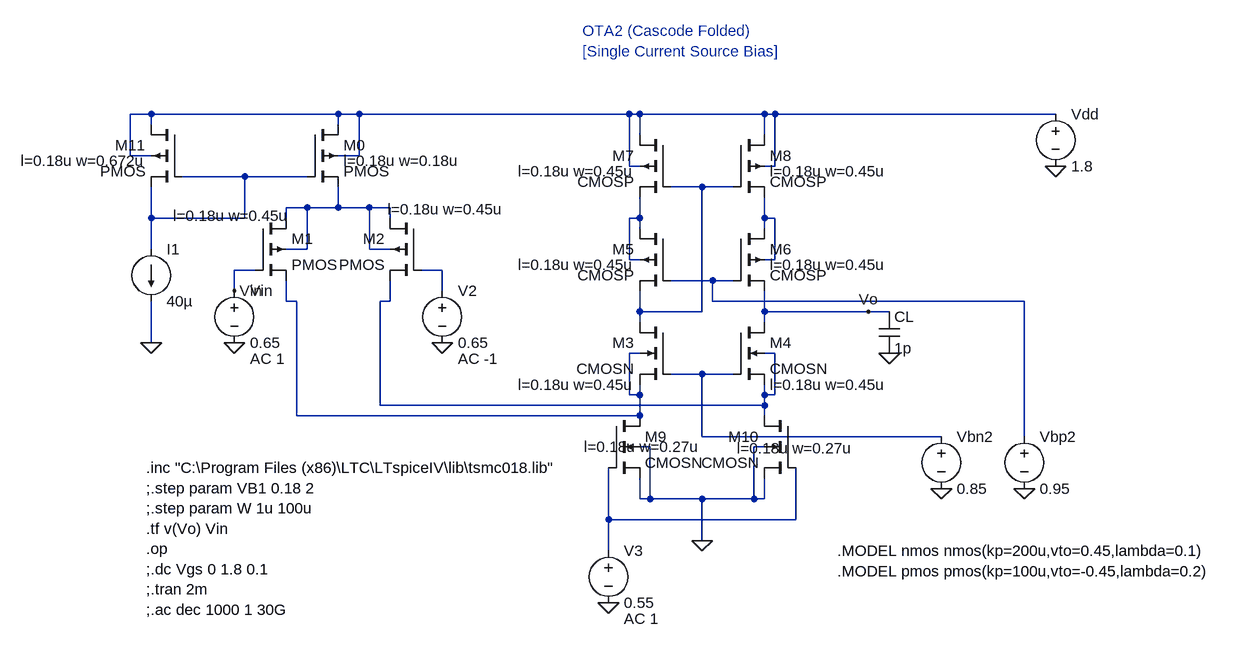
[diagram p0: schematic cascodefolded2.asc]
cascodefolded2.asc, the LTspice schematic file:
Version 4
SHEET 1 2552 708
WIRE -208 -192 -240 -192
WIRE 80 -192 -208 -192
WIRE 112 -192 80 -192
WIRE 528 -192 112 -192
WIRE 544 -192 528 -192
WIRE 736 -192 544 -192
WIRE 752 -192 736 -192
WIRE 1184 -192 752 -192
WIRE -208 -176 -208 -192
WIRE 80 -176 80 -192
WIRE 544 -160 544 -192
WIRE 736 -160 736 -192
WIRE -240 -128 -240 -192
WIRE -208 -128 -240 -128
WIRE 112 -128 112 -192
WIRE 112 -128 80 -128
WIRE 528 -112 528 -192
WIRE 544 -112 528 -112
WIRE 752 -112 752 -192
WIRE 752 -112 736 -112
WIRE -64 -96 -160 -96
WIRE 32 -96 -64 -96
WIRE 640 -80 592 -80
WIRE 688 -80 640 -80
WIRE 32 -48 0 -48
WIRE 80 -48 80 -80
WIRE 80 -48 32 -48
WIRE 128 -48 80 -48
WIRE 160 -48 128 -48
WIRE -208 -32 -208 -80
WIRE -64 -32 -64 -96
WIRE -64 -32 -208 -32
WIRE 0 -32 0 -48
WIRE 160 -32 160 -48
WIRE 544 -32 544 -64
WIRE 544 -32 528 -32
WIRE 736 -32 736 -64
WIRE 752 -32 736 -32
WIRE 544 -16 544 -32
WIRE 736 -16 736 -32
WIRE -208 16 -208 -32
WIRE 32 16 32 -48
WIRE 32 16 0 16
WIRE 128 16 128 -48
WIRE 160 16 128 16
WIRE 528 32 528 -32
WIRE 544 32 528 32
WIRE 752 32 752 -32
WIRE 752 32 736 32
WIRE -48 48 -80 48
WIRE 240 48 208 48
WIRE 656 64 592 64
WIRE 688 64 656 64
WIRE -80 80 -80 48
WIRE 240 80 240 48
WIRE 0 96 0 64
WIRE 16 96 0 96
WIRE 160 96 160 64
WIRE 160 96 144 96
WIRE 656 96 656 64
WIRE 1136 96 656 96
WIRE 544 112 544 80
WIRE 640 112 640 -80
WIRE 640 112 544 112
WIRE 736 112 736 80
WIRE 896 112 736 112
WIRE 928 112 896 112
WIRE 544 128 544 112
WIRE 736 128 736 112
WIRE -208 160 -208 96
WIRE 544 176 528 176
WIRE 752 176 736 176
WIRE 640 208 592 208
WIRE 688 208 640 208
WIRE 528 240 528 176
WIRE 544 240 544 224
WIRE 544 240 528 240
WIRE 736 240 736 224
WIRE 752 240 752 176
WIRE 752 240 736 240
WIRE 144 256 144 96
WIRE 736 256 736 240
WIRE 736 256 144 256
WIRE 16 272 16 96
WIRE 544 272 544 240
WIRE 544 272 16 272
WIRE 736 272 736 256
WIRE 640 304 640 208
WIRE 1008 304 640 304
WIRE 1136 304 1136 96
WIRE 560 320 544 320
WIRE 736 320 720 320
WIRE 544 400 544 368
WIRE 560 400 560 320
WIRE 560 400 544 400
WIRE 640 400 560 400
WIRE 720 400 720 320
WIRE 720 400 640 400
WIRE 736 400 736 368
WIRE 736 400 720 400
WIRE 496 432 496 352
WIRE 784 432 784 352
WIRE 784 432 496 432
WIRE 640 464 640 400
WIRE 496 480 496 432
FLAG 1184 -112 0
FLAG 1008 384 0
FLAG -80 160 0
FLAG 240 160 0
FLAG 928 176 0
FLAG 896 112 Vo
FLAG 640 464 0
FLAG 496 560 0
FLAG -208 160 0
FLAG 1136 384 0
FLAG -80 80 Vin
SYMBOL voltage 1184 -208 R0
WINDOW 123 0 0 Left 2
WINDOW 39 0 0 Left 2
SYMATTR InstName Vdd
SYMATTR Value 1.8
SYMBOL cmosn 496 272 R0
WINDOW 123 -38 48 Left 2
SYMATTR Value2 l=0.18u w=0.27u
SYMATTR InstName M9
SYMBOL cmosn 784 272 M0
WINDOW 123 -89 50 Left 2
SYMATTR Value2 l=0.18u w=0.27u
SYMATTR InstName M10
SYMBOL cmosn 592 128 M0
WINDOW 123 56 96 Left 2
SYMATTR Value2 l=0.18u w=0.45u
SYMATTR InstName M3
SYMBOL cmosn 688 128 R0
WINDOW 123 56 96 Left 2
SYMATTR Value2 l=0.18u w=0.45u
SYMATTR InstName M4
SYMBOL cmosp 688 -16 R0
WINDOW 123 56 56 Left 2
SYMATTR Value2 l=0.18u w=0.45u
SYMATTR InstName M6
SYMBOL cmosp 592 -16 M0
WINDOW 123 56 56 Left 2
SYMATTR Value2 l=0.18u w=0.45u
SYMATTR InstName M5
SYMBOL cmosp 592 -160 M0
WINDOW 123 56 56 Left 2
SYMATTR Value2 l=0.18u w=0.45u
SYMATTR InstName M7
SYMBOL cmosp 688 -160 R0
WINDOW 123 56 56 Left 2
SYMATTR Value2 l=0.18u w=0.45u
SYMATTR InstName M8
SYMBOL voltage 1008 288 R0
WINDOW 123 0 0 Left 2
WINDOW 39 0 0 Left 2
SYMATTR InstName Vbn2
SYMATTR Value 0.85
SYMBOL voltage -80 64 R0
WINDOW 123 24 120 Left 2
WINDOW 39 0 0 Left 2
SYMATTR Value2 AC 1
SYMATTR InstName Vin
SYMATTR Value 0.65
SYMBOL voltage 240 64 R0
WINDOW 123 24 120 Left 2
WINDOW 39 0 0 Left 2
SYMATTR Value2 AC -1
SYMATTR InstName V2
SYMATTR Value 0.65
SYMBOL cap 912 112 R0
SYMATTR InstName CL
SYMATTR Value 1p
SYMBOL voltage 496 464 R0
WINDOW 123 24 120 Left 2
WINDOW 39 0 0 Left 2
SYMATTR Value2 AC 1
SYMATTR InstName V3
SYMATTR Value 0.55
SYMBOL current -208 16 R0
WINDOW 123 0 0 Left 2
WINDOW 39 0 0 Left 2
SYMATTR InstName I1
SYMATTR Value 40µ
SYMBOL pmos4 -48 -32 R0
WINDOW 123 -126 -4 Left 2
SYMATTR Value2 l=0.18u w=0.45u
SYMATTR InstName M1
SYMBOL pmos4 208 -32 M0
WINDOW 123 -127 -14 Left 2
SYMATTR Value2 l=0.18u w=0.45u
SYMATTR InstName M2
SYMBOL voltage 1136 288 R0
WINDOW 123 0 0 Left 2
WINDOW 39 0 0 Left 2
SYMATTR InstName Vbp2
SYMATTR Value 0.95
SYMBOL pmos4 32 -176 R0
WINDOW 123 56 56 Left 2
SYMATTR Value2 l=0.18u w=0.18u
SYMATTR InstName M0
SYMBOL pmos4 -160 -176 M0
WINDOW 123 56 56 Left 2
SYMATTR Value2 l=0.18u w=0.672u
SYMATTR InstName M11
TEXT 456 -320 Left 2 ;OTA2 (Cascode Folded)\n[Single Current Source Bias]
TEXT -216 352 Left 2 !.inc "C:\\Program Files (x86)\\LTC\\LTspiceIV\\lib\\tsmc018.lib"\n;.step param VB1 0.18 2\n;.step param W 1u 100u\n.tf v(Vo) Vin\n.op\n;.dc Vgs 0 1.8 0.1\n;.tran 2m\n;.ac dec 1000 1 30G
TEXT 848 480 Left 2 !.MODEL nmos nmos(kp=200u,vto=0.45,lambda=0.1)\n.MODEL pmos pmos(kp=100u,vto=-0.45,lambda=0.2)

The netlist it stands for:
* cascodefolded2.asc
Vdd N001 0 1.8
M9 N009 N012 0 0 CMOSN l=0.18u w=0.27u
M10 N010 N012 0 0 CMOSN l=0.18u w=0.27u
M3 N003 N011 N009 N009 CMOSN l=0.18u w=0.45u
M4 Vo N011 N010 N010 CMOSN l=0.18u w=0.45u
M6 N006 N008 Vo N006 CMOSP l=0.18u w=0.45u
M5 N005 N008 N003 N005 CMOSP l=0.18u w=0.45u
M7 N001 N003 N005 N001 CMOSP l=0.18u w=0.45u
M8 N001 N003 N006 N001 CMOSP l=0.18u w=0.45u
Vbn2 N011 0 0.85
Vin Vin 0 0.65 AC 1
V2 N007 0 0.65 AC -1
CL Vo 0 1p
V3 N012 0 0.55 AC 1
I1 N002 0 40µ
M1 N004 Vin N009 N004 PMOS l=0.18u w=0.45u
M2 N004 N007 N010 N004 PMOS l=0.18u w=0.45u
Vbp2 N008 0 0.95
M0 N001 N002 N004 N001 PMOS l=0.18u w=0.18u
M11 N001 N002 N002 N001 PMOS l=0.18u w=0.672u
.model NMOS NMOS
.model PMOS PMOS
.lib standard.mos
* OTA2 (Cascode Folded)
* [Single Current Source Bias]
.inc "C:\Program Files (x86)\LTC\LTspiceIV\lib\tsmc018.lib"
;.step param VB1 0.18 2
;.step param W 1u 100u
.tf v(Vo) Vin
.op
;.dc Vgs 0 1.8 0.1
;.tran 2m
;.ac dec 1000 1 30G
.MODEL nmos nmos(kp=200u,vto=0.45,lambda=0.1)
.MODEL pmos pmos(kp=100u,vto=-0.45,lambda=0.2)
.backanno
.end